# EAGLE schematic LoLin-alarm-BMP180-DHT11 (EAGLE 7.5.0)
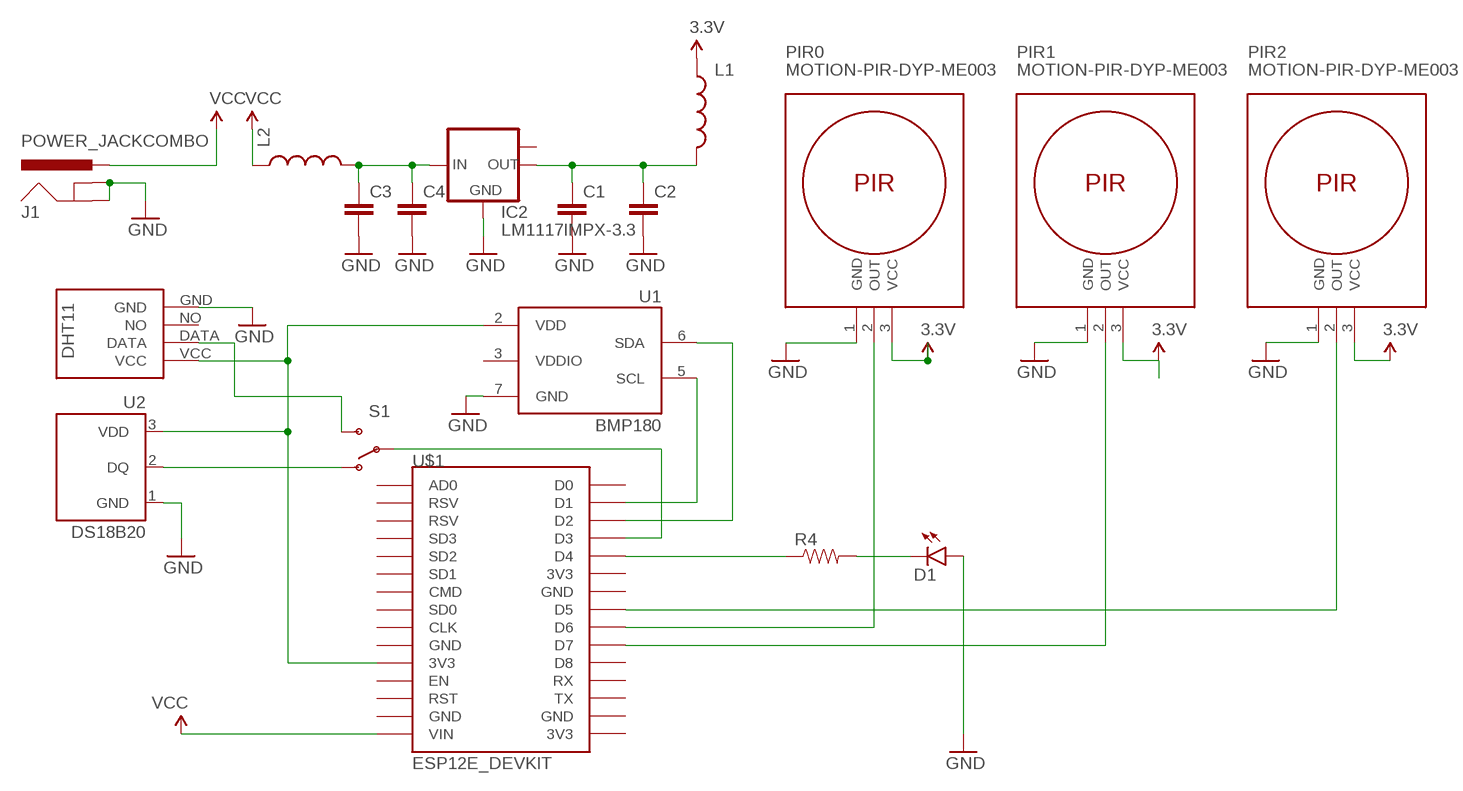
[diagram p0: schematic, sheet 1]

## Parts
C1  CAPPTH  [CAP-PTH-SMALL]
C2  CAPPTH  [CAP-PTH-SMALL]
C3  CAPPTH  [CAP-PTH-SMALL]
C4  CAPPTH  [CAP-PTH-SMALL]
D1  LED5MM  [LED5MM]
IC2  LM1117IMPX-3.3  [SOT223]
J1  POWER_JACKCOMBO  [POWER_JACK_COMBO]
L1  INDUCTOR  [INDUCTOR-SRP4020]
L2  INDUCTOR  [INDUCTOR-SRP4020]
PIR0  MOTION-PIR-DYP-ME003  [MOTION-PIR-DYP-ME003]
PIR1  MOTION-PIR-DYP-ME003  [MOTION-PIR-DYP-ME003]
PIR2  MOTION-PIR-DYP-ME003  [MOTION-PIR-DYP-ME003]
R4  RESISTORPTH-1/4W  [AXIAL-0.4]
S1  SWITCH-SPDTKIT  [SWITCH-SPDT_KIT]
U1  BMP180  [BMP180]
U2  DS18B20  [TO-92-AMMO]
U$1  ESP12E_DEVKIT  [ESP12E_DEVKIT]
U$8  DHT11  [DHT11]

## Nets
3.3V: L1.P$1 PIR0.3(VCC) PIR1.3(VCC) PIR2.3(VCC)
GND: C2.2 C3.2 C4.2 D1.A IC2.1(GND) J1.GND(GNDBREAK) J1.GND@1(GND) PIR0.1(GND) PIR1.1(GND) PIR2.1(GND) U1.7(GND) U2.1(GND) U$8.GND
N$1: PIR1.2(OUT) U$1.D7
N$2: PIR2.2(OUT) U$1.D5
N$3: PIR0.2(OUT) U$1.D6
N$4: C3.1 C4.1 IC2.3(IN) L2.P$2
N$5: C1.2 ; supply symbol labelled GND
N$6: R4.P$1 U$1.D4
N$7: D1.K(C) R4.P$2
N$8: C1.1 C2.1 IC2.2(OUT) L1.P$2
N$9: U1.5(SCL) U$1.D1
N$10: S1.3(S) U$8.DATA
N$11: U1.6(SDA) U$1.D2
N$12: U1.2(VDD) U2.3(VDD) U$1.3V3@0(3V3) U$8.VCC
N$13: S1.2(P) U$1.D3
N$14: S1.1(O) U2.2(DQ)
VCC: J1.POWER(PWR) L2.P$1 U$1.VIN
Unconnected: IC2.TAB(OUT1) U$1.3V3@1(3V3) U$1.3V3@2(3V3) U$1.AD0 U$1.CLK U$1.CMD U$1.D0 U$1.D8 U$1.EN U$1.GND@0(GND) U$1.GND@1(GND) U$1.GND@2(GND) U$1.GND@3(GND) U$1.RST U$1.RSV@0(RSV) U$1.RSV@1(RSV) U$1.RX U$1.SD0 U$1.SD1 U$1.SD2 U$1.SD3 U$1.TX U$8.NO

## Power pins joined to a net without a drawn wire
VDDIO: U1.3(VDDIO)

## Library data of the parts
C1-C4 = SparkFun-Passives:CAP: Capacitor Standard 0603 ceramic capacitor, and 0.1" leaded capacitor.
D1 = SparkFun-LED:LED: LEDs Standard schematic elements and footprints for 5mm, 3mm, 1206, and 0603 sized LEDs. 5mm - Spark Fun Electronics SKU : COM-00529 (and others)
IC2 = lm1117:LM1117IMPX-*
J1 = SparkFun-Connectors:POWER_JACK: Power Jack This is the standard 5.5mm barrel jack for power. The PTH is the most common, proven, reliable, footprint. The Slot footprint only works if the mill layer is transmitted to the PCB fab house so be warned. Mating wall wart : TOL-00298 (and others)
L1 L2 = SparkFun-Passives:INDUCTOR: Inductors Basic Inductor/Choke - 0603 and 1206. Footprints are not proven and vary greatly between part numbers. INDUCTOR POWER 3.3UH 4.0A SMD 0.197" L x 0.197" W x 0.177" H (5.00mm x 5.00mm x 4.50mm)
PIR0 PIR1 PIR2 = diymodules:MOTION-PIR-DYP-ME003: PIR Motion Sensor Module DYP-ME003 based on BISS0001 pyroelectic detector
R4 = SparkFun-Resistors:RESISTOR: Resistor Basic schematic elements and footprints for 0603, 1206, and PTH resistors.
S1 = SparkFun-Electromechanical:SWITCH-SPDT: SPDT Switch Simple slide switch, Spark Fun Electronics SKU : COM-00102 DPDT SMT slide switch, AYZ0202, SWCH-08179; PROD_ID: SWCH-08261
U1 = SparkFun-Sensors:BMP180: BOSCH BMP180 DIGITAL BAROMETRIC PRESSURE SENSOR Web page: http://www.bosch-sensortec.com/en/homepage/products_3/environmental_sensors_1/bmp180_1/bmp180 Datasheet: http://ae-bst.resource.bosch.com/media/products/dokumente/bmp180/BST-BMP180-DS000-09.pdf The BMP180 is the function compatible successor of the BMP085, a new generation of high precision digital pressure sensors for consumer applications. The ultra-low power, low voltage electronics of the BMP180 is optimized for use in mobile phones, PDAs, GPS navigation devices and outdoor equipment. With a low altitude noise of merely 0.25m at fast conversion time, the BMP180 offers superior performance. The I2C interface allows for easy system integration with a microcontroller. The BMP180 is based on piezo-resistive technology for EMC robustness, high accuracy and linearity as well as long term stability. Key features: - Temperature measurement included - I2C interface - Fully calibrated - Pb-free, halogen-free and RoHS compliant, - MSL 1 Basic specs: Pressure range: 300 to 1100hPa (+9000m to -500m relating to sea level) Supply voltage: 1.8 to 3.6V (VDD), 1.62V to 3.6V (VDDIO) Package: LGA package with metal lid Small footprint: 3.6mm x 3.8mm Super-flat: 0.93mm height Low power: 5μA at 1 sample / sec. in standard mode Low noise: 0.06hPa (0.5m) in ultra low power mode, 0.02hPa (0.17m) advanced resolution mode Typical applications: - Enhancement of GPS navigation (dead-reckoning, slope detection, etc.) - In- and out-door navigation - Leisure and sports - Weather forecast - Vertical velocity indication (rise/sink speed)
U2 = SparkFun-Sensors:DS18B20: Dallas/Maxim DS18B20 1-wire temperature sensor Datasheet: http://datasheets.maximintegrated.com/en/ds/DS18B20.pdf temp thermometer 1-wire one-wire one wire; STORE_ID: SEN-00245
U$1 = ESP12E_DEVKIT:ESP12E_DEVKIT: ESP12E DEVKIT BOARD
U$8 = DHT11:DHT11: DHT11 Czujnik temperatury i wilgotności